# EAGLE schematic Schéma_projet_Pi4B (EAGLE 9.7.0)
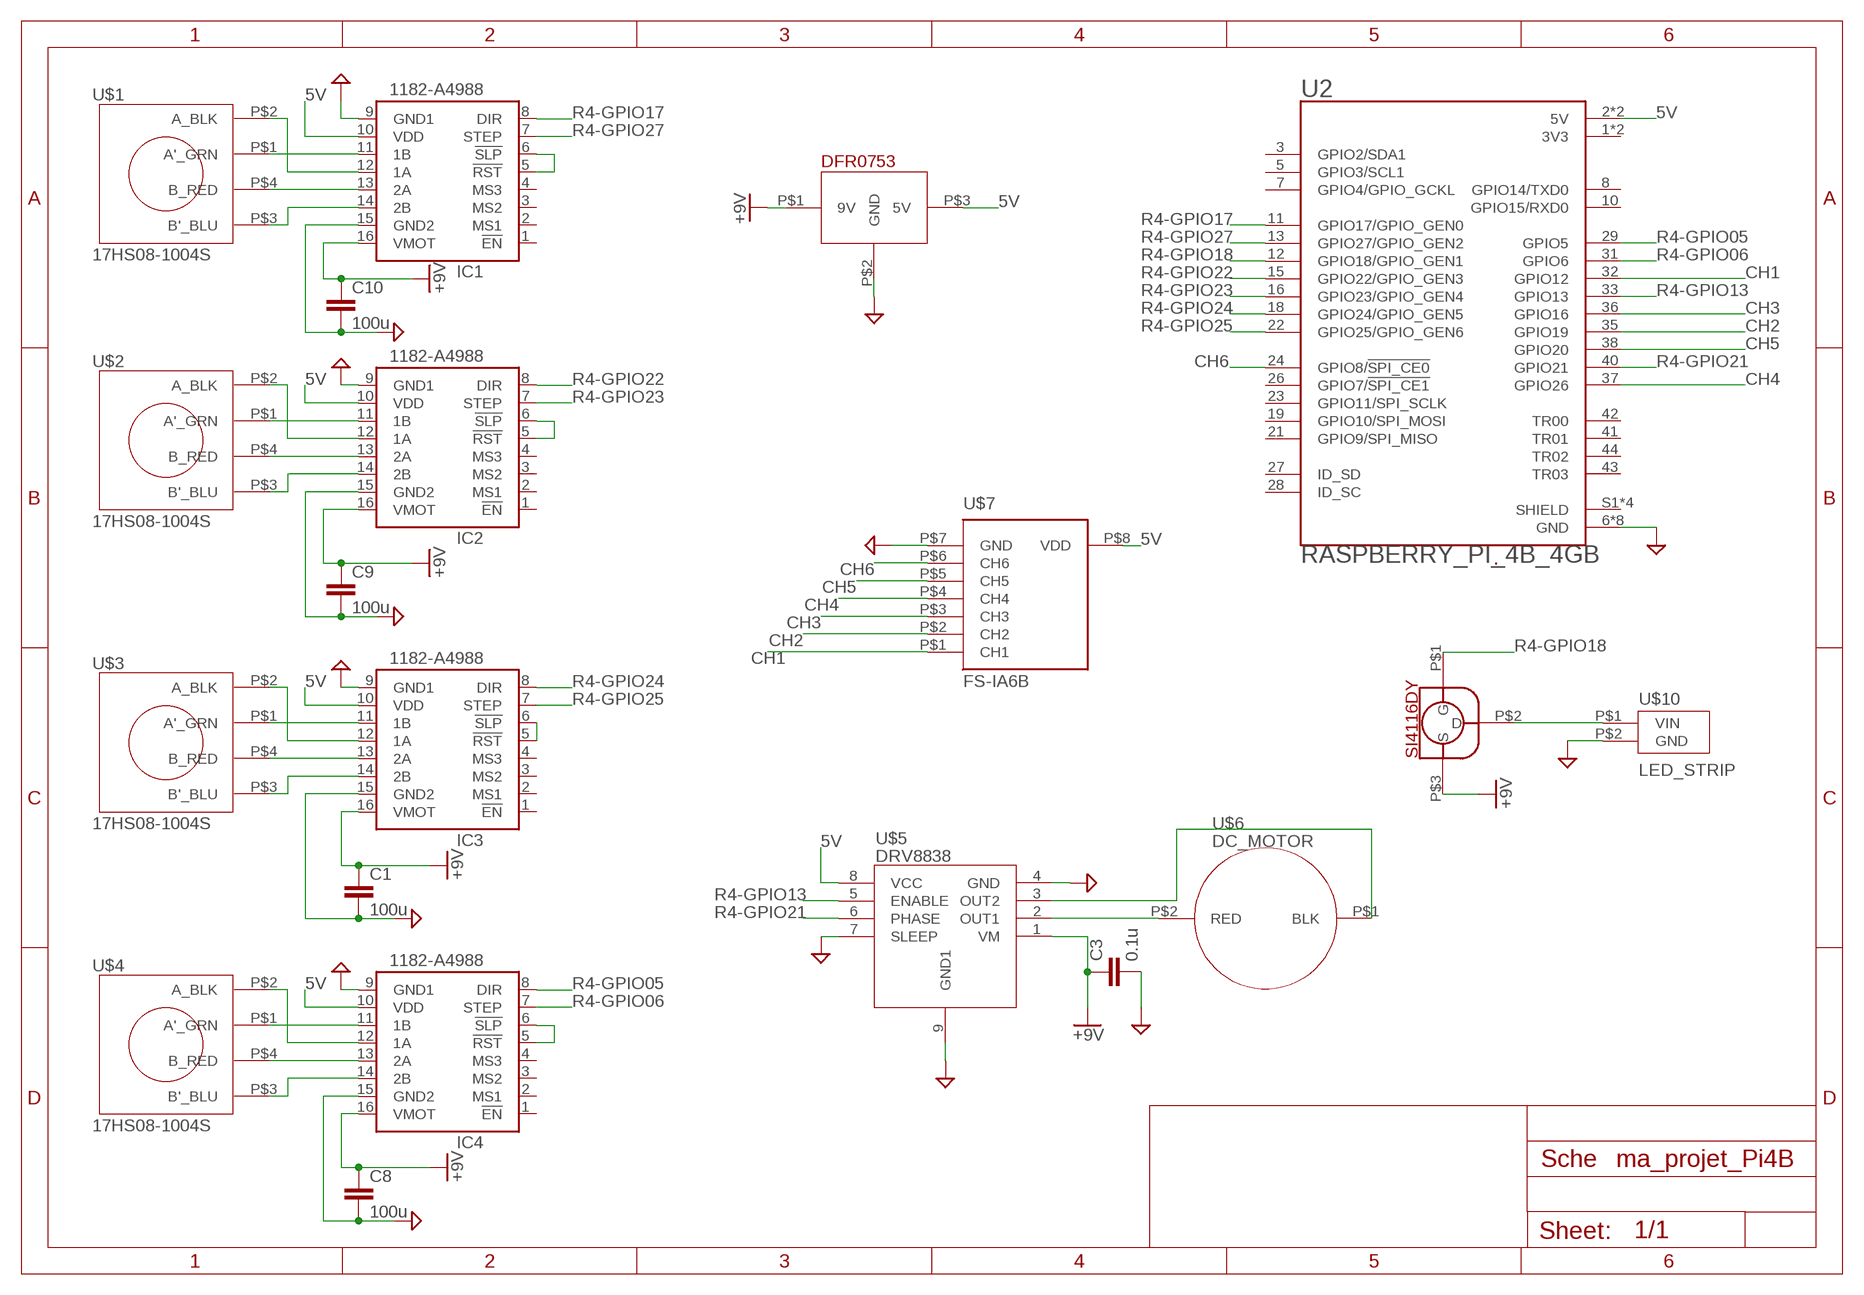
[diagram p0: schematic, sheet 1]

## Parts
C1  100u  C-EUC0603  [C0603]
C3  0.1u  C-EUC0603  [C0603]
C8  100u  C-EUC0603  [C0603]
C9  100u  C-EUC0603  [C0603]
C10  100u  C-EUC0603  [C0603]
IC1  1182-A4988  [A4988]
IC2  1182-A4988  [A4988]
IC3  1182-A4988  [A4988]
IC4  1182-A4988  [A4988]
U2  RASPBERRY_PI_4B_4GB  [MODULE_RASPBERRY_PI_4B_4GB]
U$1  17HS08-1004S  [17HS08-1004S]
U$2  17HS08-1004S  [17HS08-1004S]
U$3  17HS08-1004S  [17HS08-1004S]
U$4  17HS08-1004S  [17HS08-1004S]
U$5  DRV8838  [DRV8838]
U$6  DC_MOTOR  [DC_MOTOR]
U$7  FS-IA6B  [FS-IA6B]
U$8  SI4116DY  [SI4116DY]
U$10  LED_STRIP  [LED_STRIP]
U$11  DFR0753  [DFR0753]

## Nets
5V: IC1.10(VDD) IC2.10(VDD) IC3.10(VDD) IC4.10(VDD) U2.2(5V) U2.4(5V) U$5.8(VCC) U$7.P$8(VDD) U$11.P$3(5V)
+9V: C1.1 C8.1 C9.1 C10.1 IC1.16(VMOT) IC2.16(VMOT) IC3.16(VMOT) IC4.16(VMOT) U$8.P$3(S) U$11.P$1(9V)
AGND: C1.2 C3.2 IC2.9(GND1) IC3.9(GND1) IC3.15(GND2) IC4.9(GND1) U2.6(GND) U2.9(GND) U2.14(GND) U2.20(GND) U2.25(GND) U2.30(GND) U2.34(GND) U2.39(GND) U$5.4(GND) U$5.7(SLEEP) U$5.9(GND1) U$7.P$7(GND) U$10.P$2(GND) U$11.P$2(GND)
CH1: U$7.P$1(CH1)
CH2: U$7.P$2(CH2)
CH3: U$7.P$3(CH3)
CH4: U$7.P$4(CH4)
CH5: U$7.P$5(CH5)
CH6: U2.24(GPIO8/!SPI_CE0!) U$7.P$6(CH6)
N$1: C8.2 IC4.15(GND2) ; supply symbol labelled AGND
N$2: U$5.3(OUT2) U$6.P$1(BLK)
N$3: U$5.2(OUT1) U$6.P$2(RED)
N$4: IC1.12(1A) U$1.P$2(A_BLK)
N$5: IC1.11(1B) U$1.P$1(A'_GRN)
N$6: IC1.13(2A) U$1.P$4(B_RED)
N$7: IC1.14(2B) U$1.P$3(B'_BLU)
N$8: IC2.12(1A) U$2.P$2(A_BLK)
N$9: IC2.11(1B) U$2.P$1(A'_GRN)
N$10: IC2.13(2A) U$2.P$4(B_RED)
N$11: IC2.14(2B) U$2.P$3(B'_BLU)
N$12: IC3.12(1A) U$3.P$2(A_BLK)
N$13: IC3.11(1B) U$3.P$1(A'_GRN)
N$14: IC3.13(2A) U$3.P$4(B_RED)
N$15: IC3.14(2B) U$3.P$3(B'_BLU)
N$16: IC4.12(1A) U$4.P$2(A_BLK)
N$17: IC4.11(1B) U$4.P$1(A'_GRN)
N$18: IC4.13(2A) U$4.P$4(B_RED)
N$19: IC4.14(2B) U$4.P$3(B'_BLU)
N$20: C3.1 U$5.1(VM) ; supply symbol labelled +9V
N$21: U$8.P$2(D) U$10.P$1(VIN)
N$28: IC4.5(!RST) IC4.6(!SLP)
N$29: IC3.5(!RST) IC3.6(!SLP)
N$30: IC2.5(!RST) IC2.6(!SLP)
N$31: IC1.5(!RST) IC1.6(!SLP)
N$35: IC1.9(GND1) ; supply symbol labelled AGND
N$37: C10.2 IC1.15(GND2) ; supply symbol labelled AGND
N$38: C9.2 IC2.15(GND2) ; supply symbol labelled AGND
N$47: U2.32(GPIO12)
N$49: U2.36(GPIO16)
N$51: U2.35(GPIO19)
N$53: U2.38(GPIO20)
N$55: U2.37(GPIO26)
R4-GPIO05: IC4.8(DIR) U2.29(GPIO5)
R4-GPIO06: IC4.7(STEP) U2.31(GPIO6)
R4-GPIO13: U2.33(GPIO13) U$5.5(ENABLE)
R4-GPIO17: IC1.8(DIR) U2.11(GPIO17/GPIO_GEN0)
R4-GPIO18: U2.12(GPIO18/GPIO_GEN1) U$8.P$1(G)
R4-GPIO21: U2.40(GPIO21) U$5.6(PHASE)
R4-GPIO22: IC2.8(DIR) U2.15(GPIO22/GPIO_GEN3)
R4-GPIO23: IC2.7(STEP) U2.16(GPIO23/GPIO_GEN4)
R4-GPIO24: IC3.8(DIR) U2.18(GPIO24/GPIO_GEN5)
R4-GPIO25: IC3.7(STEP) U2.22(GPIO25/GPIO_GEN6)
R4-GPIO27: IC1.7(STEP) U2.13(GPIO27/GPIO_GEN2)
Unconnected: IC1.1(!EN) IC1.2(MS1) IC1.3(MS2) IC1.4(MS3) IC2.1(!EN) IC2.2(MS1) IC2.3(MS2) IC2.4(MS3) IC3.1(!EN) IC3.2(MS1) IC3.3(MS2) IC3.4(MS3) IC4.1(!EN) IC4.2(MS1) IC4.3(MS2) IC4.4(MS3) U2.3(GPIO2/SDA1) U2.5(GPIO3/SCL1) U2.7(GPIO4/GPIO_GCKL) U2.8(GPIO14/TXD0) U2.10(GPIO15/RXD0) U2.19(GPIO10/SPI_MOSI) U2.21(GPIO9/SPI_MISO) U2.23(GPIO11/SPI_SCLK) U2.26(GPIO7/!SPI_CE1!) U2.27(ID_SD) U2.28(ID_SC) U2.41(TR01) U2.42(TR00) U2.43(TR03) U2.44(TR02)

## Power pins joined to a net without a drawn wire
3V3: U2.1(3V3) U2.17(3V3)
SHIELD: U2.S1(SHIELD) U2.S2(SHIELD) U2.S3(SHIELD) U2.S4(SHIELD)

## Library data of the parts
C1 C3 C8-C10 = rcl:C-EU: CAPACITOR, European symbol; SPICEPREFIX: C
IC1-IC4 = pololu-stepper-driver:1182-A4988: A4988 Stepper Motor Driver Carrier #1182 A4988 Stepper Motor Driver Carrier <https://www.pololu.com/product/1182> in Japan, Suzaku Lab. Ltd. <https://suzakugiken.jp/> #1182 A4988ステッピングモータドライバ <https://szc.jp/po1182>
U2 = RASPBERRY_PI_4B_4GB:RASPBERRY_PI_4B_4GB; MANUFACTURER: Raspberry Pi; MAXIMUM_PACKAGE_HEIGHT: 16 mm; PARTREV: 4; SNAPEDA_PN: RASPBERRY PI 4B/4GB; STANDARD: Manufacturer Recommendations
U$1-U$4 = Bibliothèque_3S04:17HS08-1004S
U$5 = Bibliothèque:DRV8838
U$6 = Bibliothèque_3S04:DC_MOTOR
U$7 = Bibliothèque_3S04:FS-IA6B
U$8 = Bibliothèque:SI4116DY
U$10 = Bibliothèque_3S04:LED_STRIP
U$11 = Bibliothèque:DFR0753